# Altium schematic sheet 10_USB.SchDoc
size 420 x 297 mm; SheetNumber: 19; SheetTotal: 36
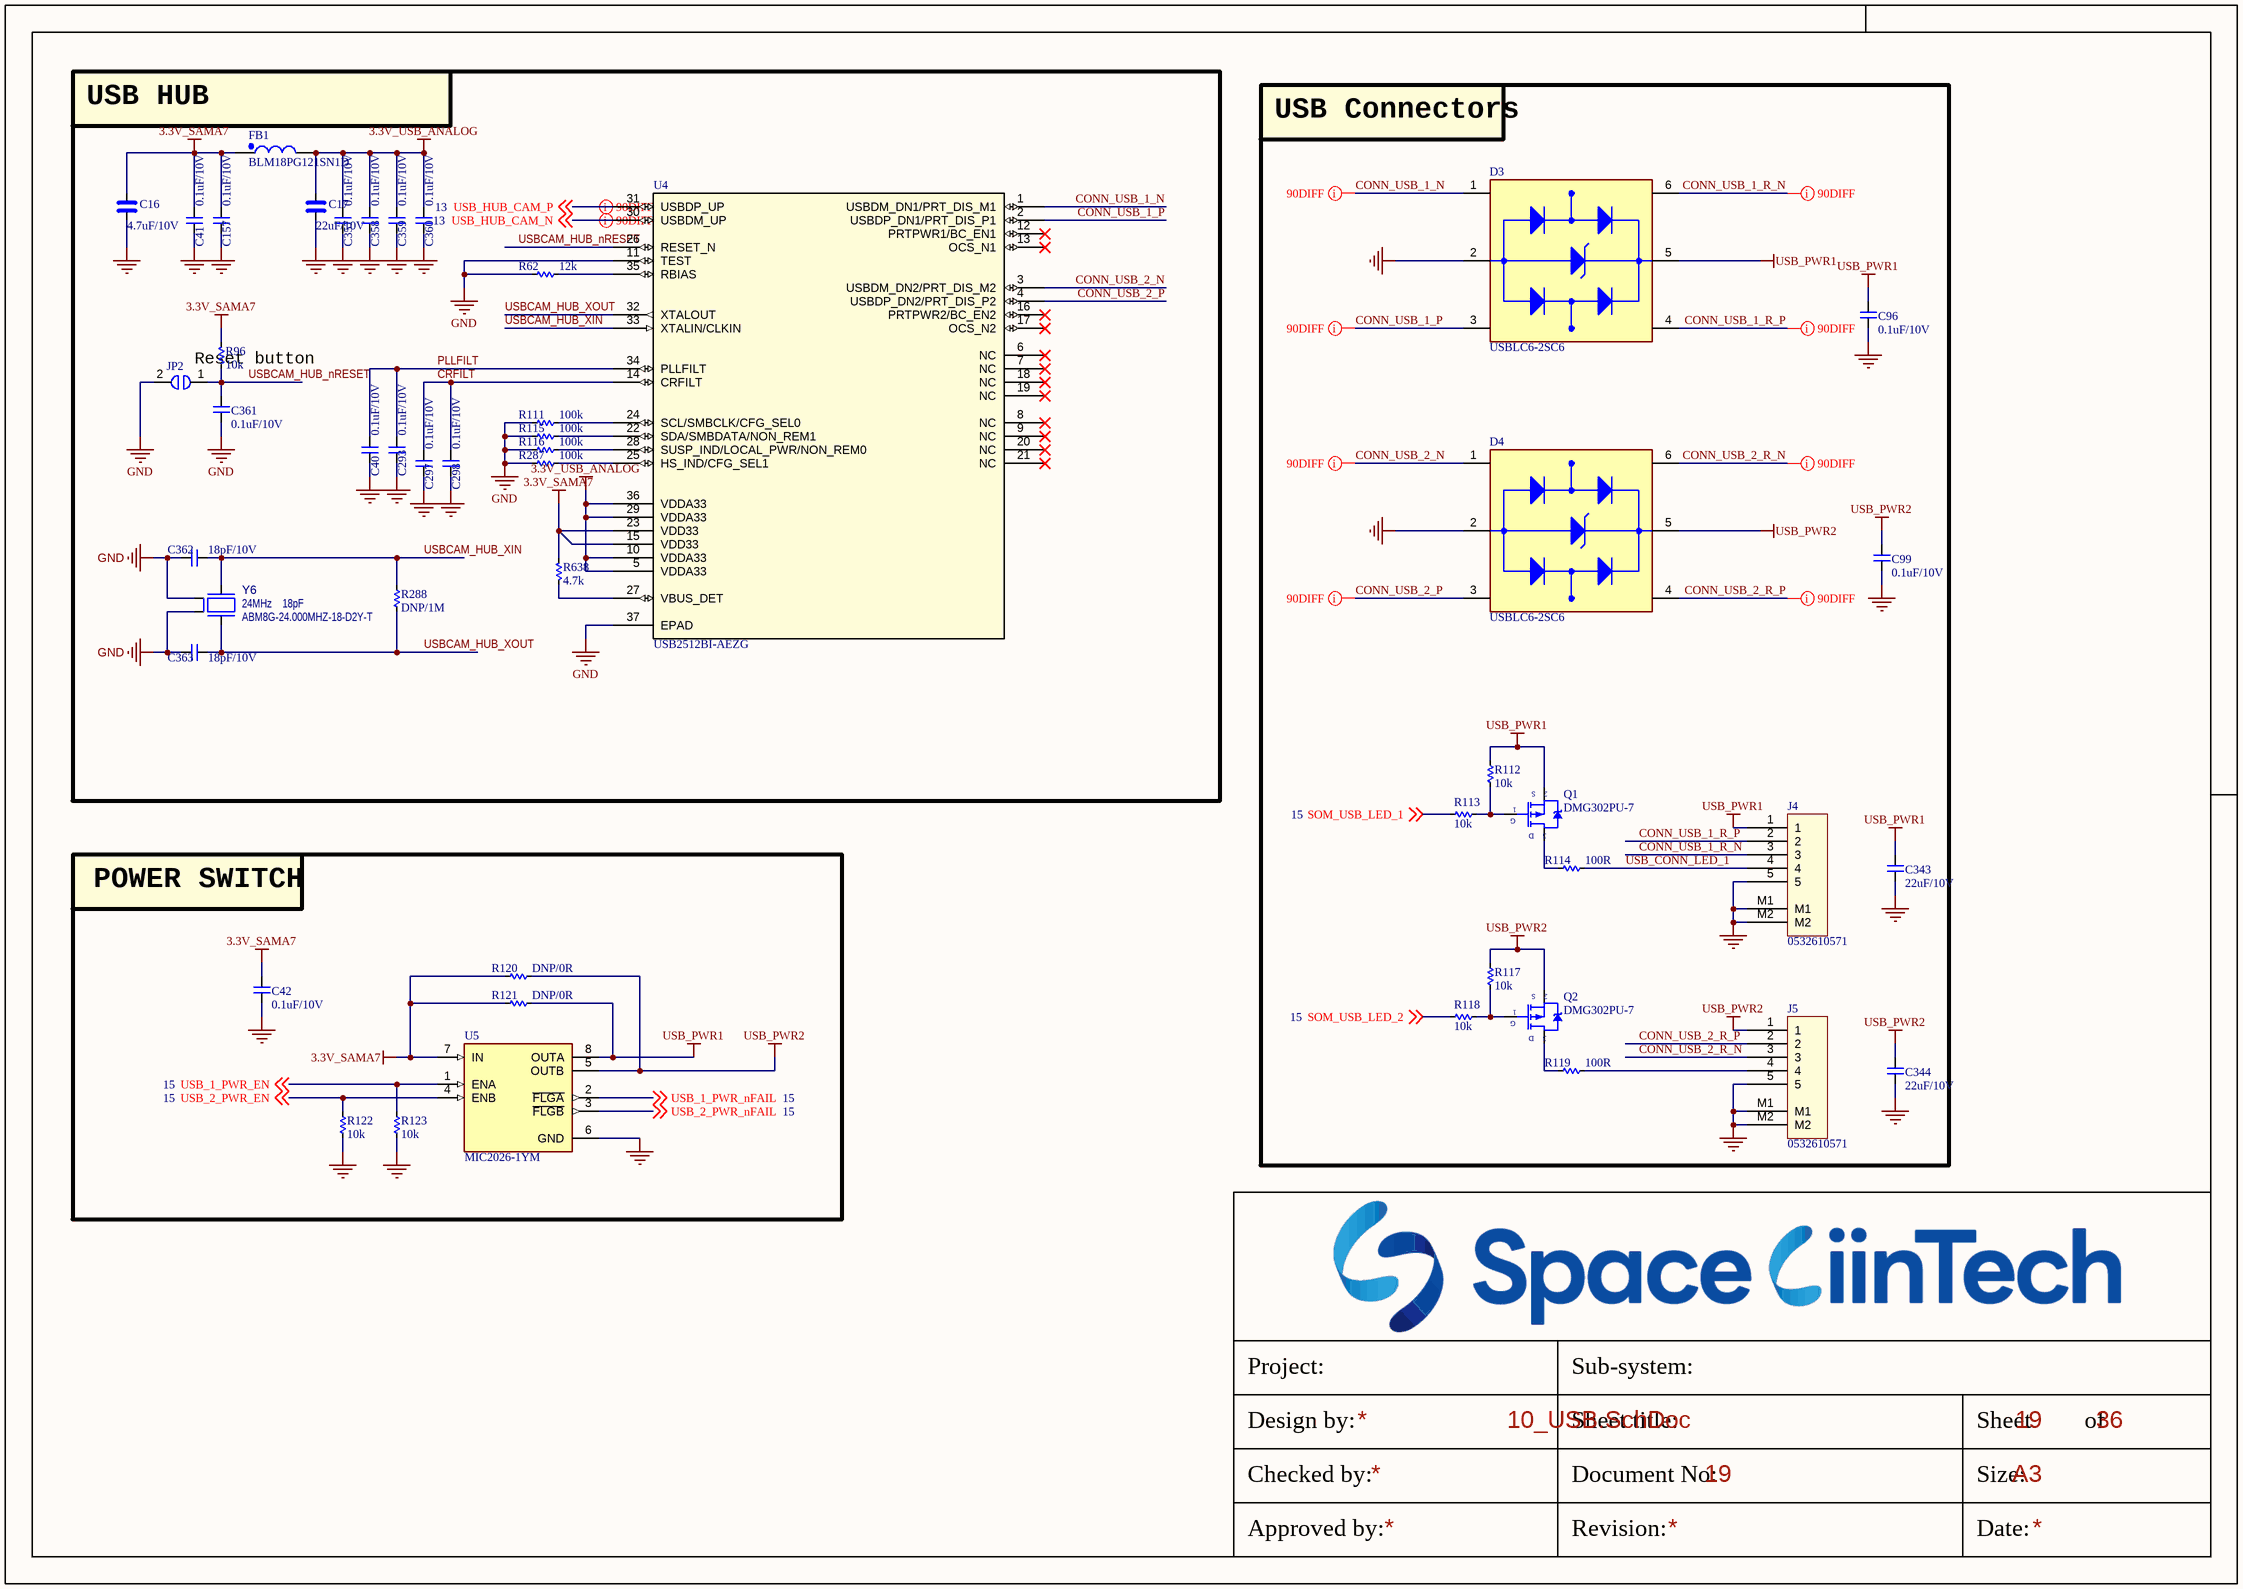
[diagram p0: 10_USB.SchDoc]

## Parts
C16  4.7uF/10V  [CAP_C_1608X80]
C17  22uF/10V  [CAP_C_1608X80]
C40  0.1uF/10V  [CAP_C_1005X60]
C41  0.1uF/10V  [CAP_C_1005X60]
C42  0.1uF/10V  [CAP_C_1005X60]
C96  0.1uF/10V  [CAP_C_1005X60]
C99  0.1uF/10V  [CAP_C_1005X60]
C157  0.1uF/10V  [CAP_C_1005X60]
C293  0.1uF/10V  [CAP_C_1005X60]
C297  0.1uF/10V  [CAP_C_1005X60]
C298  0.1uF/10V  [CAP_C_1005X60]
C343  22uF/10V  [CAP_C_1608X80]
C344  22uF/10V  [CAP_C_1608X80]
C357  0.1uF/10V  [CAP_C_1005X60]
C358  0.1uF/10V  [CAP_C_1005X60]
C359  0.1uF/10V  [CAP_C_1005X60]
C360  0.1uF/10V  [CAP_C_1005X60]
C361  0.1uF/10V  [CAP_C_1005X60]
C362  18pF/10V  [CAP_C_1005X60]
C363  18pF/10V  [CAP_C_1005X60]
D3  USBLC6-2SC6  [SOT95P280X145-6N]
D4  USBLC6-2SC6  [SOT95P280X145-6N]
FB1  BLM18PG121SN1D  [IND_C_1608X60]
J4  0532610571  [MOLEX_0532610571]
J5  0532610571  [MOLEX_0532610571]
JP2  (no value)  [TESTPOINT_SHORT_120X100_60]
Q1  DMG302PU-7  [SOT95P240X120-3N]
Q2  DMG302PU-7  [SOT95P240X120-3N]
R62  12k  [RES_C_1005X40]
R96  10k  [RES_C_1005X40]
R111  100k  [RES_C_1005X40]
R112  10k  [RES_C_1005X40]
R113  10k  [RES_C_1005X40]
R114  100R  [RES_C_1005X40]
R115  100k  [RES_C_1005X40]
R116  100k  [RES_C_1005X40]
R117  10k  [RES_C_1005X40]
R118  10k  [RES_C_1005X40]
R119  100R  [RES_C_1005X40]
R120  DNP/0R  [RES_C_1005X40]
R121  DNP/0R  [RES_C_1005X40]
R122  10k  [RES_C_1005X40]
R123  10k  [RES_C_1005X40]
R287  100k  [RES_C_1005X40]
R288  DNP/1M  [RES_C_1005X40]
R638  4.7k  [RES_C_1005X40]
U4  USB2512BI-AEZG  [QFN36_6X6MC_MCH]
U5  MIC2026-1YM  [SOIC127P602X173-8N]
Y6  value 24MHz  Load Capacitance: 18pF  Manufacturer Part Number 1: ABM8G-24.000MHZ-18-D2Y-T  [CRYSTAL_ABM8G]  (hidden comment: Crystal 4 Pins)

## Blocks framed on the sheet
USB HUB: C16 C17 C40 C41 C157 C293 C297 C298 C357-C363 FB1 JP2 R62 R96 R111 R115 R116 R287 R288 R638 U4 Y6
USB Connectors: C96 C99 C343 C344 D3 D4 J4 J5 Q1 Q2 R112-R114 R117-R119
POWER SWITCH: C42 R120-R123 U5

## Nets
3.3V_SAMA7: C16.1 C41.2 C42.2 C157.2 FB1.1 R96.1 R120.2 R121.2 R638.1 U4.15(VDD33) U4.23(VDD33) U5.7(IN)
3.3V_USB_ANALOG: C17.1 C357.2 C358.2 C359.2 C360.2 FB1.2 U4.5(VDDA33) U4.10(VDDA33) U4.29(VDDA33) U4.36(VDDA33)
GND: C16.2 C17.2 C40.1 C41.1 C42.1 C96.1 C99.1 C157.1 C293.1 C297.1 C298.1 C343.1 C344.1 C357.1 C358.1 C359.1 C360.1 C361.1 C362.2 C363.2 D3.2(GND) D4.2(GND) J4.5 J4.M1 J4.M2 J5.5 J5.M1 J5.M2 JP2.2 R62.1 R111.1 R115.1 R116.1 R122.2 R123.2 R287.1 U4.11(TEST) U4.37(EPAD) U5.6(GND) Y6.2(GND) Y6.4(GND)
USB_PWR1: C96.2 C343.2 D3.5(VBUS) J4.1 Q1.2(S) R112.1 R121.1 U5.8(OUTA)
USB_PWR2: C99.2 C344.2 D4.5(VBUS) J5.1 Q2.2(S) R117.1 R120.1 U5.5(OUTB)
CONN_USB_1_N: D3.1(I/O1_IN) U4.1(USBDM_DN1/PRT_DIS_M1)
CONN_USB_1_P: D3.3(I/O2_IN) U4.2(USBDP_DN1/PRT_DIS_P1)
CONN_USB_1_R_N: D3.6(I/O1_OUT) J4.3
CONN_USB_1_R_P: D3.4(I/O2_OUT) J4.2
CONN_USB_2_N: D4.1(I/O1_IN) U4.3(USBDM_DN2/PRT_DIS_M2)
CONN_USB_2_P: D4.3(I/O2_IN) U4.4(USBDP_DN2/PRT_DIS_P2)
CONN_USB_2_R_N: D4.6(I/O1_OUT) J5.3
CONN_USB_2_R_P: D4.4(I/O2_OUT) J5.2
CRFILT: C297.2 C298.2 U4.14(CRFILT)
PLLFILT: C40.2 C293.2 U4.34(PLLFILT)
SOM_USB_LED_1: R113.1 ; off-sheet SOM_USB_LED_1
SOM_USB_LED_2: R118.1 ; off-sheet SOM_USB_LED_2
USB_1_PWR_EN: R123.1 U5.1(ENA) ; off-sheet USB_1_PWR_EN
USB_1_PWR_nFAIL: U5.2(~{FLGA}) ; off-sheet USB_1_PWR_nFAIL
USB_2_PWR_EN: R122.1 U5.4(ENB) ; off-sheet USB_2_PWR_EN
USB_2_PWR_nFAIL: U5.3(~{FLGB}) ; off-sheet USB_2_PWR_nFAIL
USB_CONN_LED_1: J4.4 R114.2
USB_HUB_CAM_N: U4.30(USBDM_UP) ; off-sheet USB_HUB_CAM_N
USB_HUB_CAM_P: U4.31(USBDP_UP) ; off-sheet USB_HUB_CAM_P
USBCAM_HUB_nRESET: C361.2 JP2.1 R96.2 U4.26(RESET_N)
USBCAM_HUB_XIN: C362.1 R288.1 U4.33(XTALIN/CLKIN) Y6.3(Osc2)
USBCAM_HUB_XOUT: C363.1 R288.2 U4.32(XTALOUT) Y6.1(Osc1)
NetJ5_4: J5.4 R119.2
NetQ1_1: Q1.1(G) R112.2 R113.2
NetQ1_3: Q1.3(D) R114.1
NetQ2_1: Q2.1(G) R117.2 R118.2
NetQ2_3: Q2.3(D) R119.1
NetR62_2: R62.2 U4.35(RBIAS)
NetR111_2: R111.2 U4.24(SCL/SMBCLK/CFG_SEL0)
NetR115_2: R115.2 U4.22(SDA/SMBDATA/NON_REM1)
NetR116_2: R116.2 U4.28(SUSP_IND/LOCAL_PWR/NON_REM0)
NetR287_2: R287.2 U4.25(HS_IND/CFG_SEL1)
NetR638_2: R638.2 U4.27(VBUS_DET)

Not connected (* = marked no-connect by the designer): U4 6(NC)* 7(NC)* 8(NC)* 9(NC)* 12(PRTPWR1/BC_EN1)* 13(OCS_N1)* 16(PRTPWR2/BC_EN2)* 17(OCS_N2)* 18(NC)* 19(NC)* 20(NC)* 21(NC)*

## Layout directives
differential pair; differential pair class DIFF90: CONN_USB_1_N, CONN_USB_1_P, CONN_USB_1_R_N, CONN_USB_1_R_P, CONN_USB_2_N, CONN_USB_2_P, CONN_USB_2_R_N, CONN_USB_2_R_P, USB_HUB_CAM_N, USB_HUB_CAM_P

## Notes on the sheet
- (near JP2) Reset button
- Project:
- Sub-system:
- Design by:
- Sheet title:
- Sheet
- of
- Checked by:
- Approved by:
- Revision:
- Document No:
- Size:
- Date:
- A3

## Library data of the parts
C16 C17 = _CAP_C_High_2: CAP CHIP High Value
C40 C41 C157 C293 C297 C298 C357-C363 = _CAP_C_2: CAP CHIP
C42 C96 C99 C343 C344 = _CAP_C_2: CAP
D3 D4 = USBLC6-2SC6: 17V Clamp 5A (8/20Âµs) Ipp Tvs Diode Surface Mount SOT-23-6; MF: STMicroelectronics; Value: *; SnapEDA_Link: https://www.snapeda.com/parts/USBLC6-2SC6/STMicroelectronics/view-part/?ref=snap; Check_prices: https://www.snapeda.com/parts/USBLC6-2SC6/STMicroelectronics/view-part/?ref=eda; Purchase-URL: https://pricing.snapeda.com/search/part/USBLC6-2SC6/?ref=eda; Price: None; Availability: In Stock; Package: SOT-23-6 STMicroelectronics; MP: USBLC6-2SC6
FB1 = _IND
J4 J5 = Header 5x1_2M
JP2 = JUMPER_1_1
Q1 Q2 = MOSFET_P_GSD
R62 R96 R111-R123 R287 R288 R638 = _RES_B_2: RES
U4 = IC_USB_HUB_USB2512BI-AEZG: Description; Manufacturer_Name: Microchip; Copyright: Copyright (C) 2026 Ultra Librarian. All rights reserved.; Manufacturer_Part_Number: USB2512BI-AEZG; RefDes: RefDes; Type: Type
U5 = IC_PWRSW_MIC2026-1YM: Power Switch/Driver 1:2 N-Channel 1.25A 8-SOIC; MF: Microchip; SnapEDA_Link: https://www.snapeda.com/parts/MIC2026-1YM/Microchip/view-part/?ref=snap; Package: SO-8 Microchip; Value: *; MP: MIC2026-1YM; Check_prices: https://www.snapeda.com/parts/MIC2026-1YM/Microchip/view-part/?ref=eda
Y6 = OSC1047: Crystal; Manufacturer 1: Abracon Corporation; Description_: CRYSTAL 24MHz 18pF SMD ABM8G; Dev Tools Status: Production; Owner: Mark Loper; Populated: DNP; MCHP-ID: OSC1047; Revision: 1; Symbol: Crystal 4 Pins; Status: MCL Design; ComponentLink1URL: https://chn-vm-apps.microchip.com/mchprepo/parts/Datasheets/ABM8G.pdf; ComponentLink1Description: SVN Datasheet; ComponentLink2URL: C:\ALTIUM_WORK\00001_MCHP-CDB\Datasheets\ABM8G.pdf; ComponentLink2Description: Local Datasheet; ComponentLink3URL: C:\ALTIUM_WORK\00001_MCHP-CDB\Library\LibraryRefs\Crystal 4 Pins.SchLib; ComponentLink3Description: Open Symbol; ComponentLink4URL: C:\ALTIUM_WORK\00001_MCHP-CDB\Library\Footprints\CRYSTAL_ABM8G.PcbLib; ComponentLink4Description: Open Footprint; ComponentLink5Description: Open Footprint 2; ComponentLink6Description: Open Footprint 3; ComponentLink7Description: Open Footprint 4; Package: ABM8G; Type: Crystal; Category: Crystal/Oscillator; Supplier 1: Digi-Key; Supplier Part Number 1: 535-10273-1-ND; Quantity Override: 1